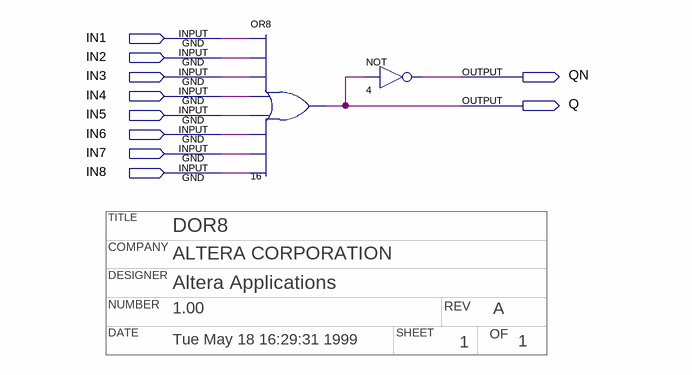
[diagram p0: schematic sheet]
// Quartus schematic dor8.bdf as structural Verilog: 2 symbols, 10 pins
// Title block: TITLE: DOR8; COMPANY: ALTERA CORPORATION; DESIGNER: Altera Applications; NUMBER: 1.00; REV: A; DATE: Tue May 18 16:29:31 1999; SHEET: 1; OF: 1
module dor8 (
  input  IN1,
  input  IN2,
  input  IN3,
  input  IN4,
  input  IN5,
  input  IN6,
  input  IN7,
  input  IN8,
  output QN,
  output Q
);

  or u_16 (Q, IN1, IN2, IN3, IN4, IN5, IN6, IN7, IN8);
  not u_4 (QN, Q);
endmodule
